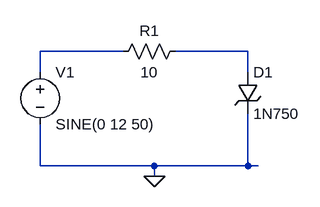
[diagram p0: schematic Draft2.asc]
Draft2.asc, the LTspice schematic file:
Version 4
SHEET 1 880 680
WIRE 432 272 304 272
WIRE 624 272 512 272
WIRE 304 304 304 272
WIRE 624 304 624 272
WIRE 624 448 624 368
WIRE 304 448 304 384
WIRE 480 448 304 448
WIRE 624 448 480 448
WIRE 640 448 624 448
WIRE 480 464 480 448
FLAG 480 464 0
SYMBOL zener 608 304 R0
SYMATTR InstName D1
SYMATTR Value 1N750
SYMATTR Description Diode
SYMATTR Type diode
SYMBOL res 528 256 R90
WINDOW 0 0 56 VBottom 2
WINDOW 3 32 56 VTop 2
SYMATTR InstName R1
SYMATTR Value 10
SYMBOL voltage 304 288 R0
SYMATTR InstName V1
SYMATTR Value SINE(0 12 50)

The netlist it stands for:
* Draft2.asc
D1 N002 0 1N750
R1 N002 N001 10
V1 N001 0 SINE(0 12 50)
.model D D
.lib standard.dio
.backanno
.end